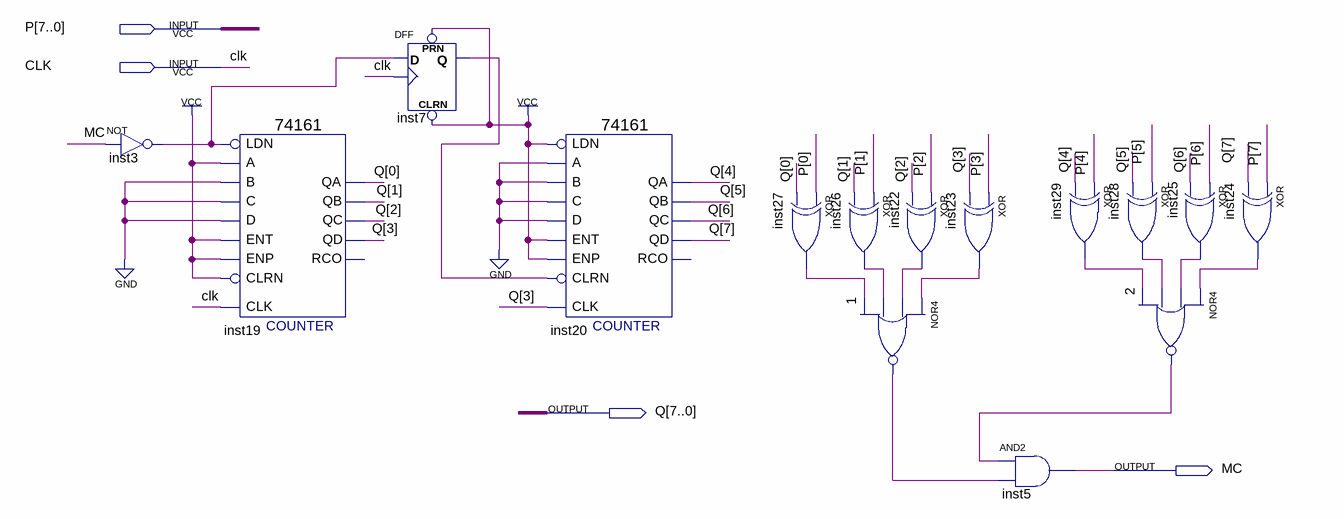
[diagram p0: schematic sheet]
// Quartus schematic PulseCounter.bdf as structural Verilog: 15 symbols, 4 pins
module PulseCounter (
  input  [7:0] P,
  input  CLK,
  output [7:0] Q,
  output MC
);

  wire inst3_out, inst7_q, inst22_out, inst23_out, inst24_out, inst25_out, inst26_out, inst27_out,
       inst28_out, inst29_out, n1_out, n2_out;

  not inst3 (inst3_out, MC);
  \74161  inst19 (
    .CLRN(1'b1), .CLK(CLK), .ENP(1'b1), .LDN(inst3_out), .A(1'b1), .D(1'b0), .ENT(1'b1), .B(1'b0), .C(1'b0),
    .QD(Q[3]), .QC(Q[2]), .QB(Q[1]), .QA(Q[0]));  // open: RCO
  DFF inst7 (.CLRN(1'b1), .CLK(CLK), .D(inst3_out), .PRN(1'b1), .Q(inst7_q));
  \74161  inst20 (
    .CLRN(inst7_q), .CLK(Q[3]), .ENP(1'b1), .LDN(1'b1), .A(1'b0), .D(1'b0), .ENT(1'b1), .B(1'b0), .C(1'b0),
    .QD(Q[7]), .QC(Q[6]), .QB(Q[5]), .QA(Q[4]));  // open: RCO
  xor inst27 (inst27_out, P[0], Q[0]);
  xor inst26 (inst26_out, P[1], Q[1]);
  xor inst22 (inst22_out, P[2], Q[2]);
  nor u_1 (n1_out, inst23_out, inst22_out, inst26_out, inst27_out);
  xor inst23 (inst23_out, P[3], Q[3]);
  and inst5 (MC, n2_out, n1_out);
  xor inst28 (inst28_out, P[5], Q[5]);
  xor inst29 (inst29_out, P[4], Q[4]);
  nor u_2 (n2_out, inst24_out, inst25_out, inst28_out, inst29_out);
  xor inst25 (inst25_out, P[6], Q[6]);
  xor inst24 (inst24_out, P[7], Q[7]);
endmodule
